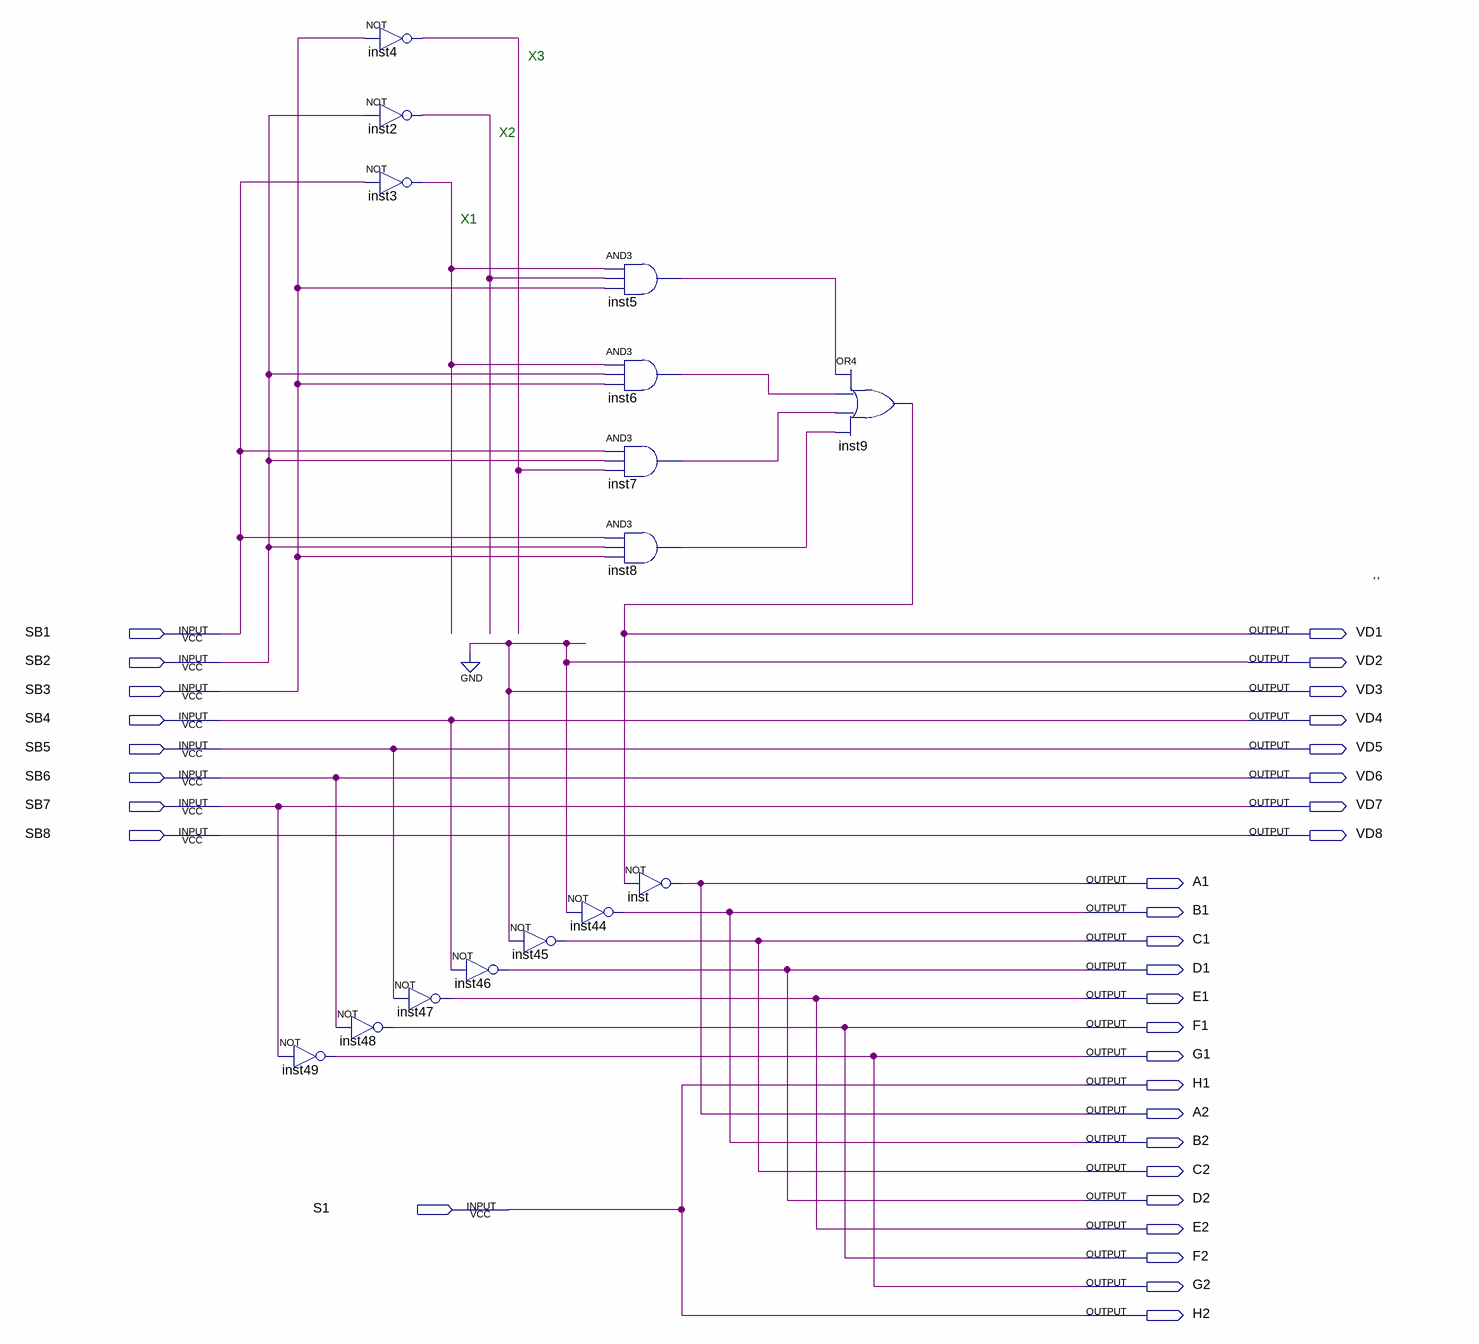
[diagram p0: schematic sheet]
// Quartus schematic test_2_2.bdf as structural Verilog: 15 symbols, 33 pins
module test_2_2 (
  input  SB1,
  input  SB2,
  input  SB3,
  input  SB4,
  input  SB5,
  input  SB6,
  input  SB7,
  input  SB8,
  input  S1,
  output VD1,
  output VD2,
  output VD3,
  output VD4,
  output VD5,
  output VD6,
  output VD7,
  output VD8,
  output A1,
  output B1,
  output C1,
  output D1,
  output E1,
  output F1,
  output G1,
  output H1,
  output A2,
  output B2,
  output C2,
  output D2,
  output E2,
  output F2,
  output G2,
  output H2
);

  wire inst2_out, inst3_out, inst4_out, inst5_out, inst6_out, inst7_out, inst8_out;

  not inst48 (F1, SB6);
  not inst49 (G1, SB7);
  not inst4 (inst4_out, SB3);
  not inst2 (inst2_out, SB2);
  not inst3 (inst3_out, SB1);
  not inst47 (E1, SB5);
  not inst46 (D1, SB4);
  not inst44 (B1, 1'b0);
  not inst45 (C1, 1'b0);
  and inst5 (inst5_out, inst3_out, inst2_out, SB3);
  and inst6 (inst6_out, inst3_out, SB2, SB3);
  and inst7 (inst7_out, SB1, SB2, inst4_out);
  and inst8 (inst8_out, SB1, SB2, SB3);
  not inst (A1, VD1);
  or inst9 (VD1, inst5_out, inst6_out, inst7_out, inst8_out);

  assign A2 = A1;
  assign B2 = B1;
  assign C2 = C1;
  assign D2 = D1;
  assign E2 = E1;
  assign F2 = F1;
  assign G2 = G1;
  assign H1 = S1;
  assign H2 = S1;
  assign VD2 = 1'b0;
  assign VD3 = 1'b0;
  assign VD4 = SB4;
  assign VD5 = SB5;
  assign VD6 = SB6;
  assign VD7 = SB7;
  assign VD8 = SB8;

  // Notes on the sheet:
  //   X3
  //   X2
  //   X1
  //   ,,
endmodule
